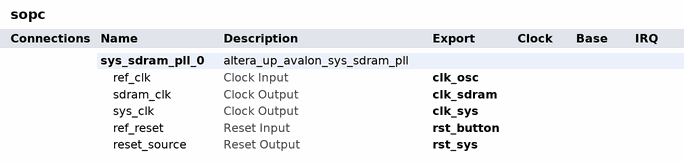
[diagram p0: system contents]
# Platform Designer (Qsys) system sopc, Cyclone IV E EP4CE22F17C6
# Parameters at their usual value, and those the tool derives, are not listed.
package require -exact qsys 15.1
create_system sopc
set_project_property DEVICE_FAMILY {Cyclone IV E}
set_project_property DEVICE EP4CE22F17C6

add_instance sys_sdram_pll_0 altera_up_avalon_sys_sdram_pll 15.1
set_instance_parameter_value sys_sdram_pll_0 CIV_boards DE0-Nano
set_instance_parameter_value sys_sdram_pll_0 CV_boards DE1-SoC
set_instance_parameter_value sys_sdram_pll_0 gui_outclk 50.0
set_instance_parameter_value sys_sdram_pll_0 gui_refclk 50.0

# exported interfaces
add_interface clk_osc clock sink
set_interface_property clk_osc EXPORT_OF sys_sdram_pll_0.ref_clk
add_interface clk_sdram clock source
set_interface_property clk_sdram EXPORT_OF sys_sdram_pll_0.sdram_clk
add_interface clk_sys clock source
set_interface_property clk_sys EXPORT_OF sys_sdram_pll_0.sys_clk
add_interface rst_button reset sink
set_interface_property rst_button EXPORT_OF sys_sdram_pll_0.ref_reset
add_interface rst_sys reset source
set_interface_property rst_sys EXPORT_OF sys_sdram_pll_0.reset_source

set_interconnect_requirement {$system} qsys_mm.clockCrossingAdapter HANDSHAKE
set_interconnect_requirement {$system} qsys_mm.enableEccProtection FALSE
set_interconnect_requirement {$system} qsys_mm.insertDefaultSlave FALSE
set_interconnect_requirement {$system} qsys_mm.maxAdditionalLatency 1

save_system sopc.qsys
